# Altium schematic sheet CAN.SchDoc
size A4
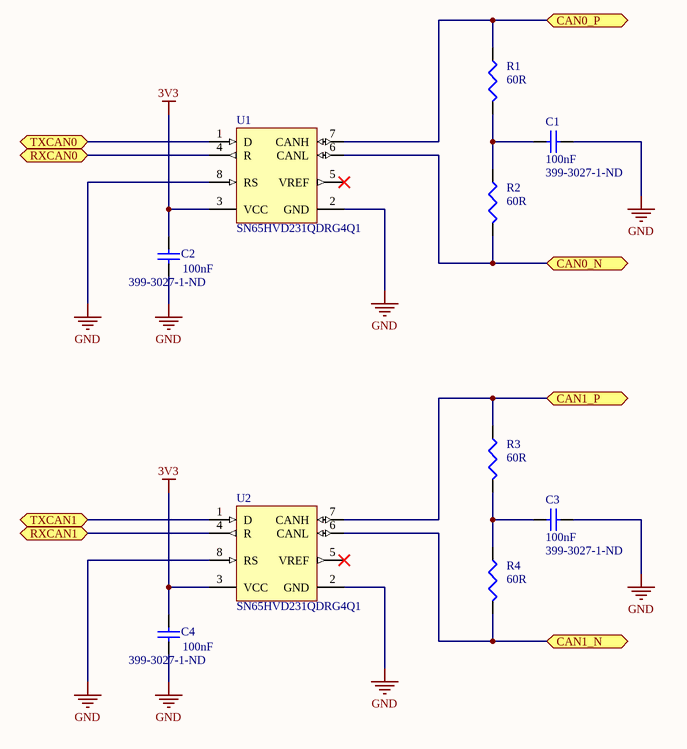
[diagram p0: CAN.SchDoc]

## Parts
C1  value 100nF  Supplier Part Number 1: 399-3027-1-ND  [0402C-TBD]  (hidden comment: Cap Semi)
C2  value 100nF  Supplier Part Number 1: 399-3027-1-ND  [0402C-TBD]  (hidden comment: Cap Semi)
C3  value 100nF  Supplier Part Number 1: 399-3027-1-ND  [0402C-TBD]  (hidden comment: Cap Semi)
C4  value 100nF  Supplier Part Number 1: 399-3027-1-ND  [0402C-TBD]  (hidden comment: Cap Semi)
R1  value 60R  [0402R-TBD]  (hidden comment: Res3)
R2  value 60R  [0402R-TBD]  (hidden comment: Res3)
R3  value 60R  [0402R-TBD]  (hidden comment: Res3)
R4  value 60R  [0402R-TBD]  (hidden comment: Res3)
U1  SN65HVD231QDRG4Q1  [D8_M]
U2  SN65HVD231QDRG4Q1  [D8_M]

## Ports
CAN0_N (bidir), CAN0_P (bidir), CAN1_N (bidir), CAN1_P (bidir), RXCAN0 (bidir), RXCAN1 (bidir), TXCAN0 (bidir), TXCAN1 (bidir)

## Nets
3V3: C2.1 C4.1 U1.3(VCC) U2.3(VCC)
GND: C1.2 C2.2 C3.2 C4.2 U1.2(GND) U1.8(RS) U2.2(GND) U2.8(RS)
CAN0_N: R2.2 U1.6(CANL) ; port CAN0_N
CAN0_P: R1.1 U1.7(CANH) ; port CAN0_P
CAN1_N: R4.2 U2.6(CANL) ; port CAN1_N
CAN1_P: R3.1 U2.7(CANH) ; port CAN1_P
RXCAN0: U1.4(R) ; port RXCAN0
RXCAN1: U2.4(R) ; port RXCAN1
TXCAN0: U1.1(D) ; port TXCAN0
TXCAN1: U2.1(D) ; port TXCAN1
NetC1_1: C1.1 R1.2 R2.1
NetC3_1: C3.1 R3.2 R4.1

Not connected (* = marked no-connect by the designer): U1 5(VREF)*; U2 5(VREF)*

## Library data of the parts
C1-C4 = Cap Semi: Capacitor (Semiconductor SIM Model); Manufacturer: Kemet; Manufacturer Part Number: C0402C104K8PACTU; Capacitance: 0.1µF; Tolerance: ±10%; Voltage - Rated: 10V; Temperature Coefficient: X5R; Published: 8-Jun-2000; LatestRevisionDate: 29-May-2009; LatestRevisionNote: IPC-7351 Footprint Added.; PackageReference: C1206; Publisher: Altium Limited; PackageDescription: Chip Capacitor; Supplier 1: Digi-Key; RoHS: RoHS Compliant; Category: Capacitors; Stock 1: 806297; Pricing 1: 1=0.12, 10=0.031, 50=0.0174, 100=0.0147, 250=0.012, 500=0.01028, 1000=0.00799, 2500=0.0072, 5000=0.00666 (CAD); Packaging: Cut Tape (CT); Mounting Type: Surface Mount, MLCC; Operating Temperature: -55°C ~ 85°C; Applications: General Purpose; Ratings: -; Package / Case: 0402 (1005 Metric); Size / Dimension: 0.039" L x 0.020" W (1.00mm x 0.50mm); Height - Seated (Max): -; Thickness (Max): 0.022" (0.55mm); Lead Spacing: -; Features: -; Lead Style: -; ComponentLink1URL: http://www.kemet.com/docfinder?Partnumber=C0402C104K8PACTU; ComponentLink1Description: http://www.kemet.com/docfinder?Partnumber=C0402C104K8PACTU; Digi-Key Part Number: 399-3027-1-ND
R1-R4 = Res3: Resistor; Published: 8-Jun-2000; LatestRevisionDate: 29-May-2009; LatestRevisionNote: IPC-7351 Footprint Added.; PackageReference: J1-0603; Publisher: Altium Limited; PackageDescription: Chip Resistor; Digi-Key Part Number: 541-120GCT-ND
U1 U2 = CMP-0315-00034-1: Automotive Catalog CAN Transceiver, 17 mA, 3.3 V, -40 to 125 degC, 8-pin SOIC (D), Green (RoHS & no Sb/Br); Manufacturer: Texas Instruments; ICC(Max)(mA): 17; Supply Voltage(s)(V): 3.3; Receivers Per Package: 1; Transient Pulse Protection(V): -25 to 25; Mounting Technology: Surface Mount; DatasheetVersion: SGLS398A; Eco-Plan: Green (RoHS & no Sb/Br); PackageDescription: 8-Pin Plastic Small Outline Integrated Circuit, 4.9 x 3.9 mm, Pitch 1.27 mm Pitch; ComponentLink1URL: http://www.ti.com/general/docs/lit/getliterature.tsp?genericPartNumber=SN65HVD231Q-Q1&fileType=pdf; Isolated: No; SubFamily: CAN; Rating: Automotive; ComponentLink1Description: Datasheet; PackageVersion: revM, Jun-2011; Code_JEDEC: MS-012AA; Footprint: PCA82C250; PartNumber: SN65HVD231QDRG4Q1; PackageReference: D8; Drivers Per Package: 1